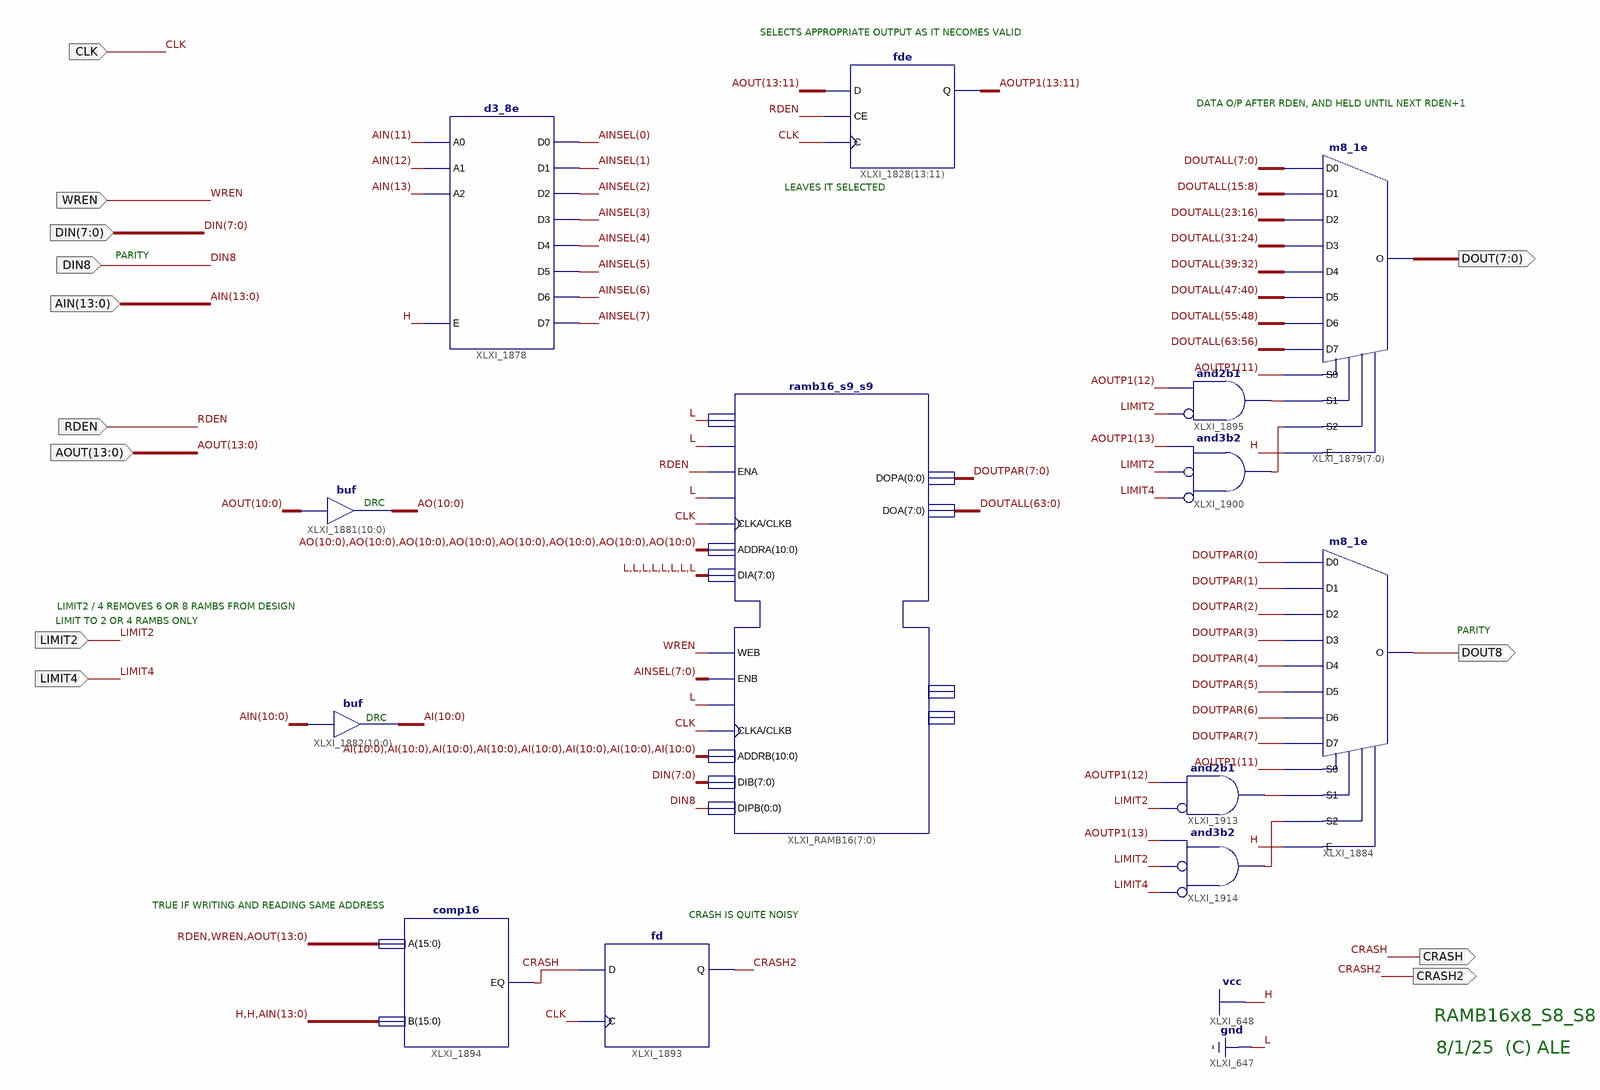
[diagram p0: schematic sheet 1]
// Xilinx ISE schematic RAMB16x8_S8_S8.sch (spartan3e) as structural Verilog: 13 symbols, 13 ports
module RAMB16x8_S8_S8 (
  input  WREN,
  input  RDEN,
  input  [13:0] AOUT,
  input  [13:0] AIN,
  input  [7:0] DIN,
  input  CLK,
  input  DIN8,
  input  LIMIT2,
  input  LIMIT4,
  output CRASH,
  output CRASH2,
  output [7:0] DOUT,
  output DOUT8
);

  wire XLXN_31, XLXN_39, XLXN_118, XLXN_119;
  wire [7:0] AINSEL, DOUTPAR;
  wire [10:0] AI, AO;
  wire [13:11] AOUTP1;
  wire [63:0] DOUTALL;

  d3_8e XLXI_1878 (
    .A0(AIN[11]), .A1(AIN[12]), .A2(AIN[13]), .E(1'b1), .D0(AINSEL[0]), .D1(AINSEL[1]), .D2(AINSEL[2]),
    .D3(AINSEL[3]), .D4(AINSEL[4]), .D5(AINSEL[5]), .D6(AINSEL[6]), .D7(AINSEL[7]));
  ramb16_s9_s9 XLXI_RAMB16[7:0] (
    .ADDRA({AO, AO, AO, AO, AO, AO, AO, AO}), .ADDRB({AI, AI, AI, AI, AI, AI, AI, AI}), .CLKA(CLK),
    .CLKB(CLK), .DIA({8{1'b0}}), .DIB(DIN), .DIPA(1'b0), .DIPB(DIN8), .ENA(RDEN), .ENB(AINSEL), .SSRA(1'b0),
    .SSRB(1'b0), .WEA(1'b0), .WEB(WREN), .DOA(DOUTALL), .DOPA(DOUTPAR));  // open: DOB, DOPB
  assign AO = AOUT[10:0];  // buf XLXI_1881[10..0], 11 bits wide
  assign AI = AIN[10:0];  // buf XLXI_1882[10..0], 11 bits wide
  fd XLXI_1893 (.C(CLK), .D(CRASH), .Q(CRASH2));
  comp16 XLXI_1894 (.A({RDEN, WREN, AOUT}), .B({2'b11, AIN}), .EQ(CRASH));
  fde XLXI_1828[13:11] (.C(CLK), .CE(RDEN), .D(AOUT[13:11]), .Q(AOUTP1));
  m8_1e XLXI_1879[7:0] (
    .D0(DOUTALL[7:0]), .D1(DOUTALL[15:8]), .D2(DOUTALL[23:16]), .D3(DOUTALL[31:24]), .D4(DOUTALL[39:32]),
    .D5(DOUTALL[47:40]), .D6(DOUTALL[55:48]), .D7(DOUTALL[63:56]), .E(1'b1), .S0(AOUTP1[11]), .S1(XLXN_39),
    .S2(XLXN_31), .O(DOUT));
  and XLXI_1895 (XLXN_39, ~LIMIT2, AOUTP1[12]);  // and2b1
  and XLXI_1900 (XLXN_31, ~LIMIT4, ~LIMIT2, AOUTP1[13]);  // and3b2
  m8_1e XLXI_1884 (
    .D0(DOUTPAR[0]), .D1(DOUTPAR[1]), .D2(DOUTPAR[2]), .D3(DOUTPAR[3]), .D4(DOUTPAR[4]), .D5(DOUTPAR[5]),
    .D6(DOUTPAR[6]), .D7(DOUTPAR[7]), .E(1'b1), .S0(AOUTP1[11]), .S1(XLXN_118), .S2(XLXN_119), .O(DOUT8));
  and XLXI_1913 (XLXN_118, ~LIMIT2, AOUTP1[12]);  // and2b1
  and XLXI_1914 (XLXN_119, ~LIMIT4, ~LIMIT2, AOUTP1[13]);  // and3b2

  // Notes on the sheet:
  //   SELECTS APPROPRIATE OUTPUT AS IT NECOMES VALID
  //   DATA O/P AFTER RDEN, AND HELD UNTIL NEXT RDEN+1
  //   LEAVES IT SELECTED
  //   PARITY
  //   DRC
  //   LIMIT2 / 4 REMOVES 6 OR 8 RAMBS FROM DESIGN
  //   LIMIT TO 2 OR 4 RAMBS ONLY
  //   PARITY
  //   DRC
  //   TRUE IF WRITING AND READING SAME ADDRESS
  //   CRASH IS QUITE NOISY
  //   RAMB16x8_S8_S8
  //   8/1/25  (C) ALE
endmodule
